# Altium schematic sheet Management_RP2040.SchDoc: Management Microcontroller
size B; CheckedBy: Jason Sullins; Author: Jordan Harris-Toovy; Revision: 0.2; SheetNumber: 2; SheetTotal: 22; Size: ANSI B
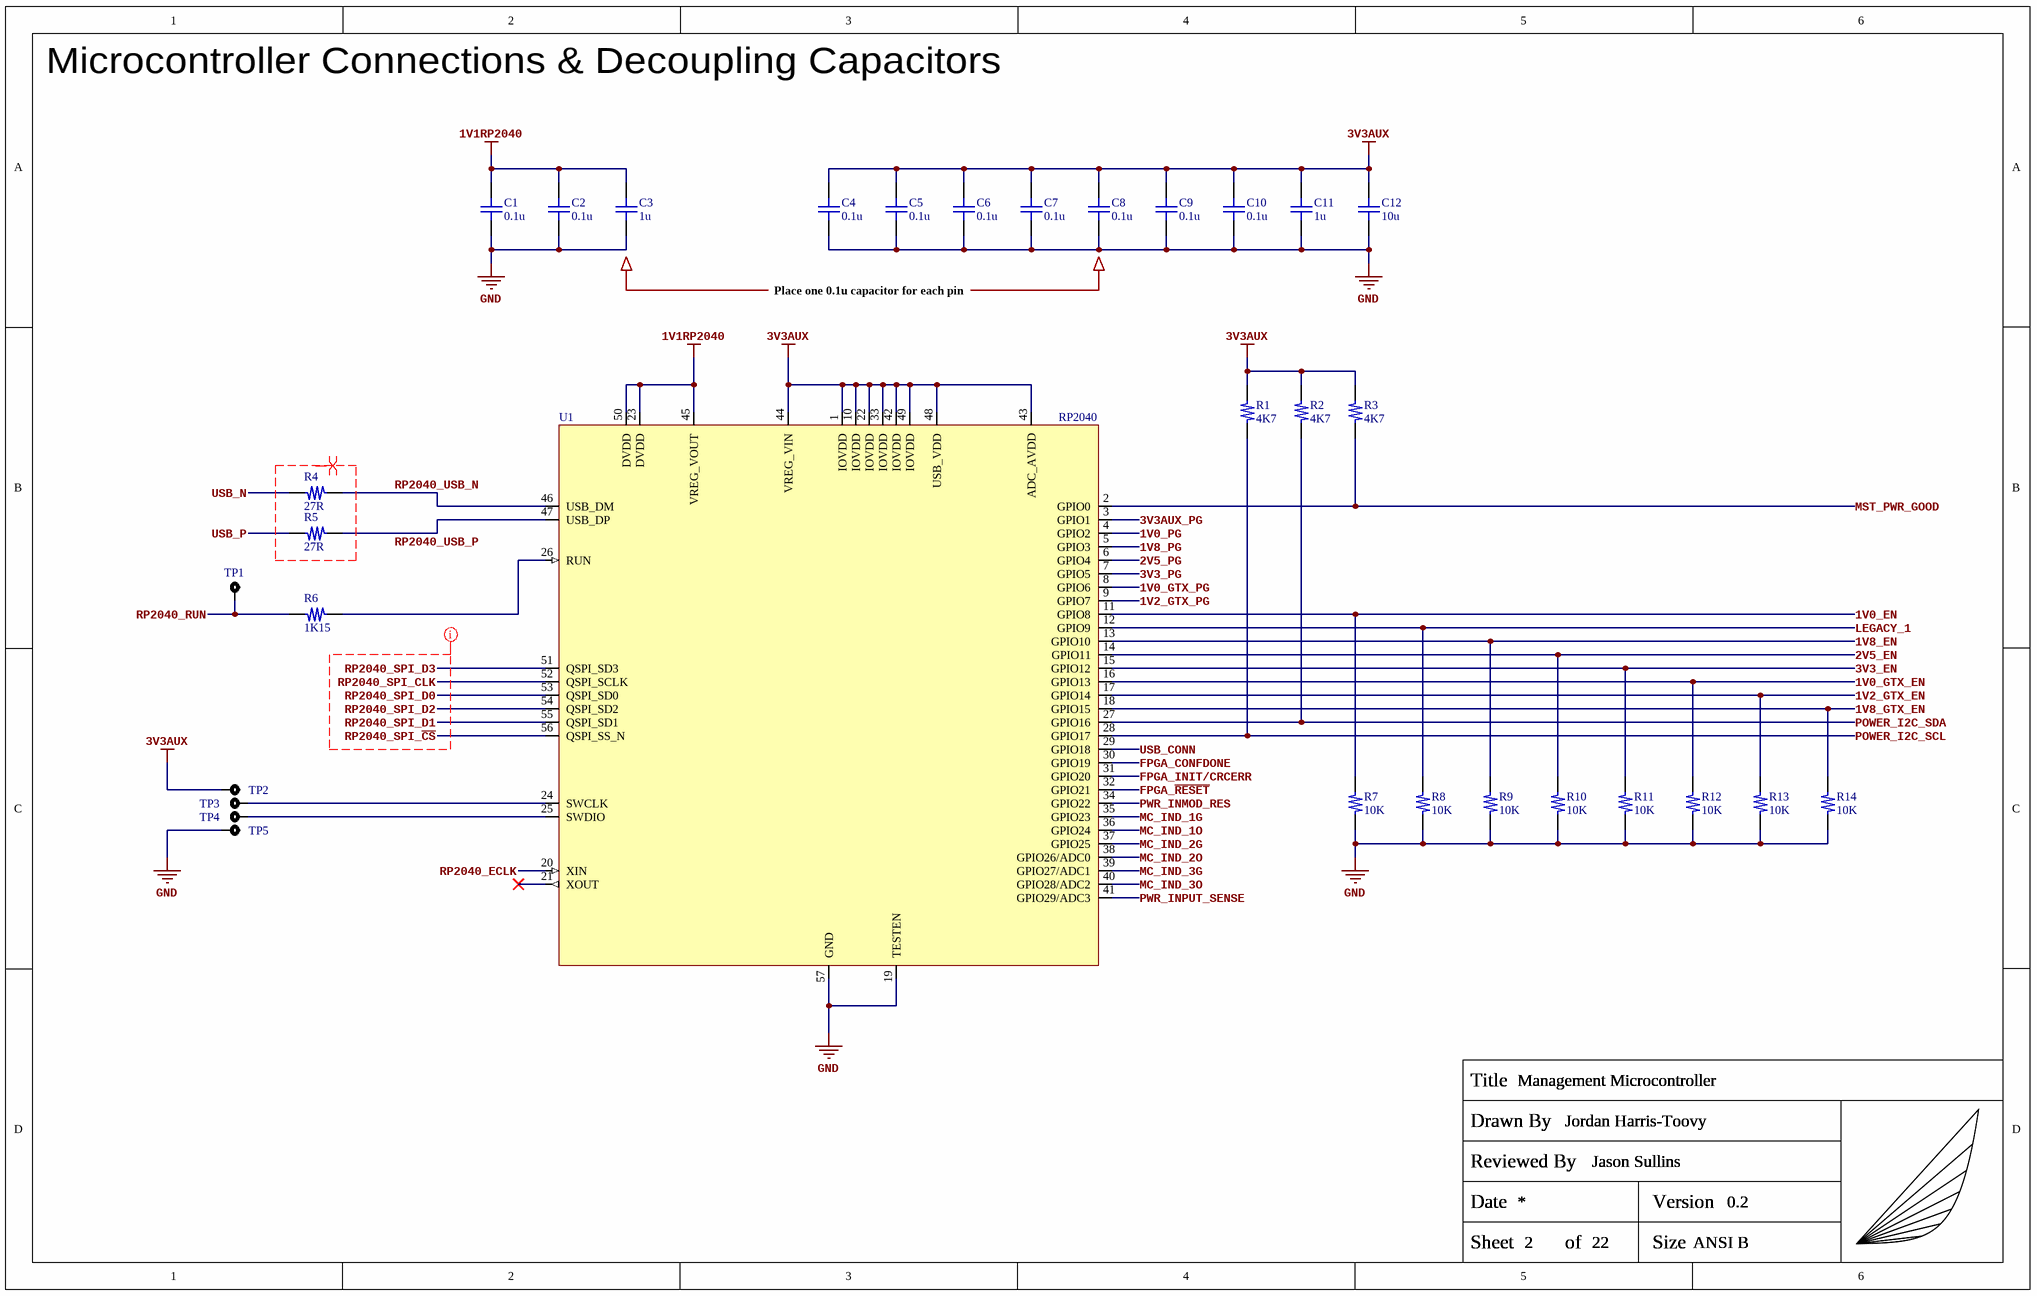
[diagram p0: Management_RP2040.SchDoc]

## Parts
C1  0.1u  [C_0402_Generic]
C2  0.1u  [C_0402_Generic]
C3  1u  [C_0402_Generic]
C4  0.1u  [C_0402_Generic]
C5  0.1u  [C_0402_Generic]
C6  0.1u  [C_0402_Generic]
C7  0.1u  [C_0402_Generic]
C8  0.1u  [C_0402_Generic]
C9  0.1u  [C_0402_Generic]
C10  0.1u  [C_0402_Generic]
C11  1u  [C_0402_Generic]
C12  10u  [C_0402_Generic]
R1  4K7  [R_0402_Generic]
R2  4K7  [R_0402_Generic]
R3  4K7  [R_0402_Generic]
R4  27R  [R_0402_Generic]
R5  27R  [R_0402_Generic]
R6  1K15  [R_0402_Generic]
R7  10K  [R_0402_Generic]
R8  10K  [R_0402_Generic]
R9  10K  [R_0402_Generic]
R10  10K  [R_0402_Generic]
R11  10K  [R_0402_Generic]
R12  10K  [R_0402_Generic]
R13  10K  [R_0402_Generic]
R14  10K  [R_0402_Generic]
TITLEBLOCK?  Capstone_Title_Block  (value not drawn)  (graphical)
TP1  RP2040_RUN Test Point  [TP_3MM]  (value not drawn)
TP2  3V3AUX Test Point  [TP_3MM]  (value not drawn)
TP3  SWCLK Test Point  [TP_3MM]  (value not drawn)
TP4  SWDIO Test Point  [TP_3MM]  (value not drawn)
TP5  SWDGND Test Point  [TP_3MM]  (value not drawn)
U1  RP2040  [RP2040/SC0914 QFN-56]

## Nets
1V1RP2040: C1.2 C2.2 C3.2 U1.23(DVDD) U1.45(VREG_VOUT) U1.50(DVDD)
3V3AUX: C4.2 C5.2 C6.2 C7.2 C8.2 C9.2 C10.2 C11.2 C12.2 R1.2 R2.2 R3.2 TP2.1 U1.1(IOVDD) U1.10(IOVDD) U1.22(IOVDD) U1.33(IOVDD) U1.42(IOVDD) U1.43(ADC_AVDD) U1.44(VREG_VIN) U1.48(USB_VDD) U1.49(IOVDD)
GND: C1.1 C2.1 C3.1 C4.1 C5.1 C6.1 C7.1 C8.1 C9.1 C10.1 C11.1 C12.1 R7.1 R8.1 R9.1 R10.1 R11.1 R12.1 R13.1 R14.1 TP5.1 U1.19(TESTEN) U1.57(GND)
1V0_EN: R7.2 U1.11(GPIO8)
1V0_GTX_EN: R12.2 U1.16(GPIO13)
1V0_GTX_PG: U1.8(GPIO6)
1V0_PG: U1.4(GPIO2)
1V2_GTX_EN: R13.2 U1.17(GPIO14)
1V2_GTX_PG: U1.9(GPIO7)
1V8_EN: R9.2 U1.13(GPIO10)
1V8_GTX_EN: R14.2 U1.18(GPIO15)
1V8_PG: U1.5(GPIO3)
2V5_EN: R10.2 U1.14(GPIO11)
2V5_PG: U1.6(GPIO4)
3V3_EN: R11.2 U1.15(GPIO12)
3V3_PG: U1.7(GPIO5)
3V3AUX_PG: U1.3(GPIO1)
FPGA_CONFDONE: U1.30(GPIO19)
FPGA_INIT/CRCERR: U1.31(GPIO20)
FPGA_~{RESET}: U1.32(GPIO21)
LEGACY_1: R8.2 U1.12(GPIO9)
MC_IND_1G: U1.35(GPIO23)
MC_IND_1O: U1.36(GPIO24)
MC_IND_2G: U1.37(GPIO25)
MC_IND_2O: U1.38(GPIO26/ADC0)
MC_IND_3G: U1.39(GPIO27/ADC1)
MC_IND_3O: U1.40(GPIO28/ADC2)
MST_PWR_GOOD: R3.1 U1.2(GPIO0)
POWER_I2C_SCL: R1.1 U1.28(GPIO17)
POWER_I2C_SDA: R2.1 U1.27(GPIO16)
PWR_INMOD_RES: U1.34(GPIO22)
PWR_INPUT_SENSE: U1.41(GPIO29/ADC3)
RP2040_ECLK: U1.20(XIN)
RP2040_RUN: R6.2 TP1.1
RP2040_SPI_~{CS}: U1.56(QSPI_SS_N)
RP2040_SPI_CLK: U1.52(QSPI_SCLK)
RP2040_SPI_D0: U1.53(QSPI_SD0)
RP2040_SPI_D1: U1.55(QSPI_SD1)
RP2040_SPI_D2: U1.54(QSPI_SD2)
RP2040_SPI_D3: U1.51(QSPI_SD3)
RP2040_USB_N: R4.2 U1.46(USB_DM)
RP2040_USB_P: R5.1 U1.47(USB_DP)
USB_CONN: U1.29(GPIO18)
USB_N: R4.1
USB_P: R5.2
NetR6_1: R6.1 U1.26(RUN)
NetTP3_1: TP3.1 U1.24(SWCLK)
NetTP4_1: TP4.1 U1.25(SWDIO)

Not connected (* = marked no-connect by the designer): U1 21(XOUT)*

## Layout directives
differential pair; differential pair class DP90_USB: (no net found under the mark)
net class SE50_RP2040_FLASH: RP2040_SPI_CLK, RP2040_SPI_D0, RP2040_SPI_D1, RP2040_SPI_D2, RP2040_SPI_D3, RP2040_SPI_~{CS}

## Notes on the sheet
- Microcontroller Connections & Decoupling Capacitors
- Place one 0.1u capacitor for each pin
- (in symbol Capstone_Title_Block) Title; Drawn By; Reviewed By; Date; Version; Sheet; of; Size

## Library data of the parts
C1 C2 C4-C10 = GRM155R71C104KA88D: 0.1µF 16V X7R SMD ceramic capacitor in 0402 size; Manufacturer: Murata Electronics; Manufacturer Part Number: GRM155R71C104KA88D
C3 C11 = GRM155Z71A105KE01D: 1µF 10V X7R SMD ceramic capacitor in 0402 size; Manufacturer: Murata Electronics; Manufacturer Part Number: GRM155Z71A105KE01D
C12 = CC0402MRX5R6BB106: 10µF 10V X5R SMD ceramic capacitor in 0402 size; Manufacturer: YAGEO; Manufacturer Part Number: CC0402MRX5R6BB106
R1-R3 = ERJ-2RKF4701X: 4.7KOhm 1% 1/10W SMD resistor in 0402 size; Manufacturer: Panasonic; Manufacturer Part Number: ERJ-2RKF4701X
R4 R5 = ERJ-2RKF27R0X: 27Ohm 1% 1/10W SMD resistor in 0402 size; Manufacturer: Panasonic; Manufacturer Part Number: ERJ-2RKF27R0X
R6 = ERJ-2RKF1151X: 1.15KOhm 1% 1/10W SMD resistor in 0402 size; Manufacturer: Panasonic; Manufacturer Part Number: ERJ-2RKF1151X
R7-R14 = ERJ-2RKF1002X: 10KOhm 1% 1/10W SMD resistor in 0402 size; Manufacturer: Panasonic; Manufacturer Part Number: ERJ-2RKF1002X
TITLEBLOCK? = Capstone_Title_Block: Custom title block with personal logo; Manufacturer: NONE; Manufacturer Part Number: NONE
TP1-TP5 = SMD Test Point: SMD Test point 3mm circle; Manufacturer: NONE; Manufacturer Part Number: NONE
U1 = RP2040/SC0914: ARM Cortex-M0+ - Microcontroller IC 32-Bit Dual-Core 133MHz External Program Memory 56-QFN (7x7); Manufacturer: Raspberry Pi; Manufacturer Part Number: SC0914(7)